# Altium schematic sheet Amplifier.SchDoc
size D; SheetNumber: 1; SheetTotal: 1
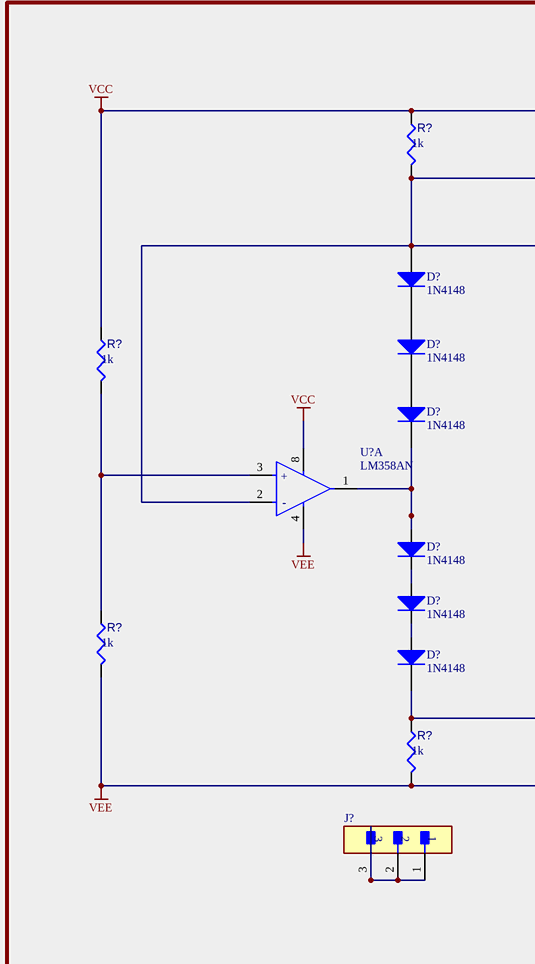
[diagram p0: Amplifier.SchDoc, top left]
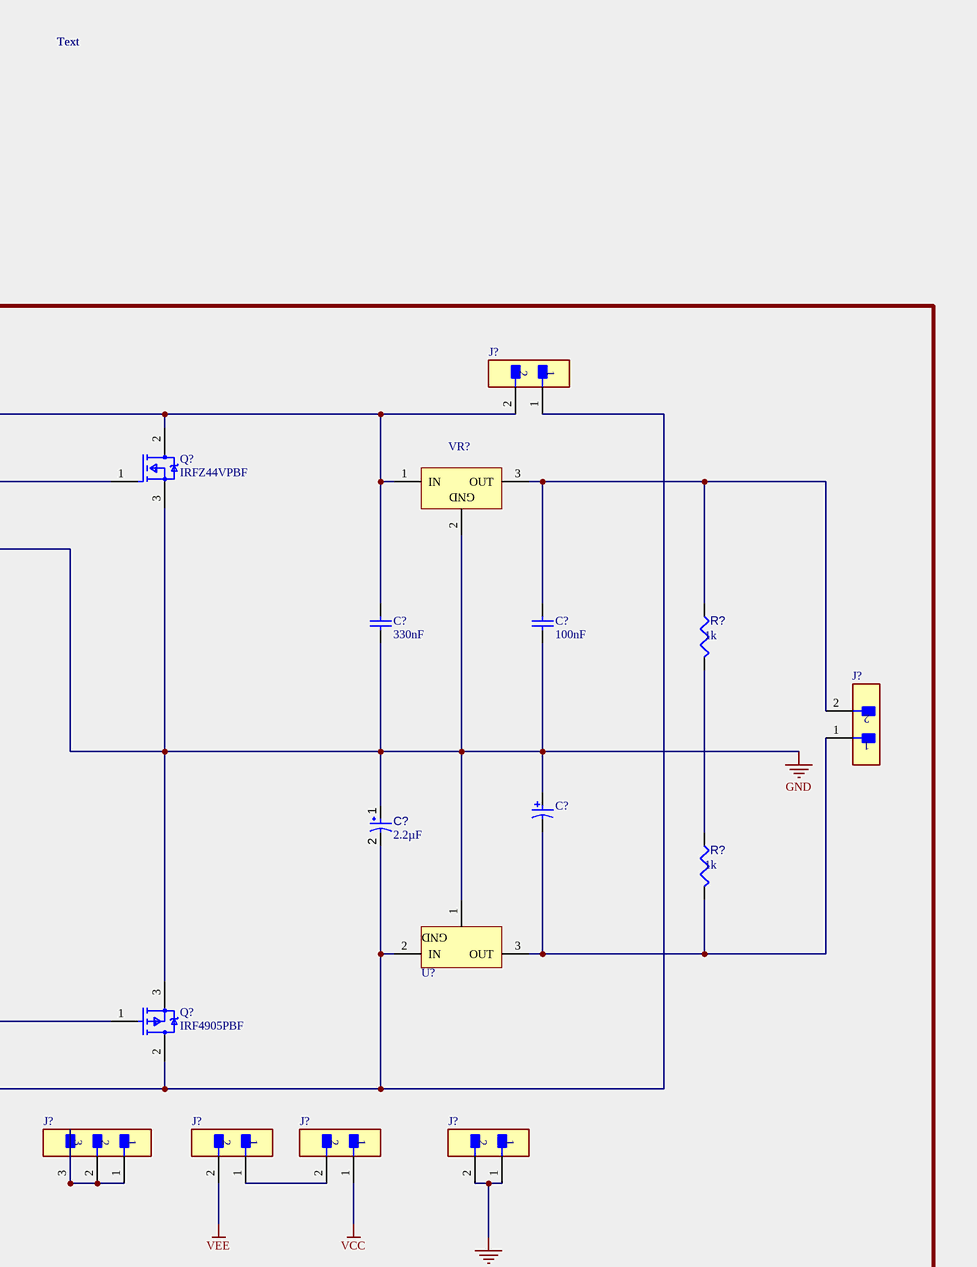
[diagram p1: Amplifier.SchDoc, top middle]
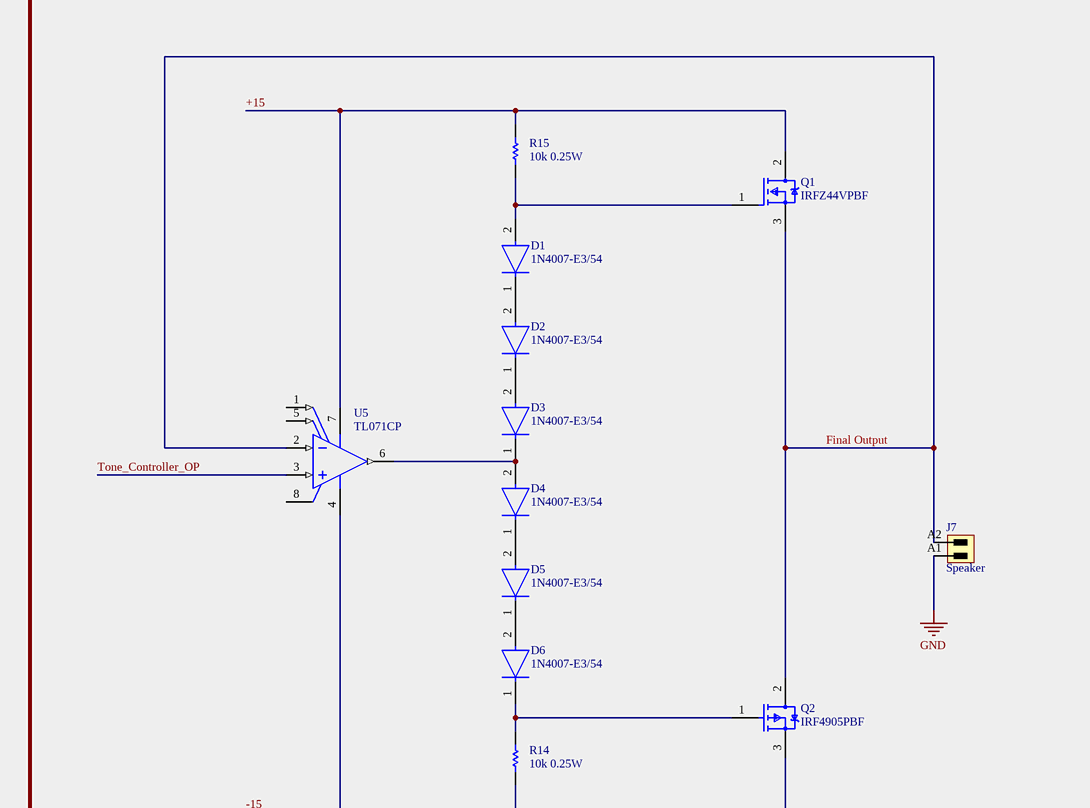
[diagram p2: Amplifier.SchDoc, top right]
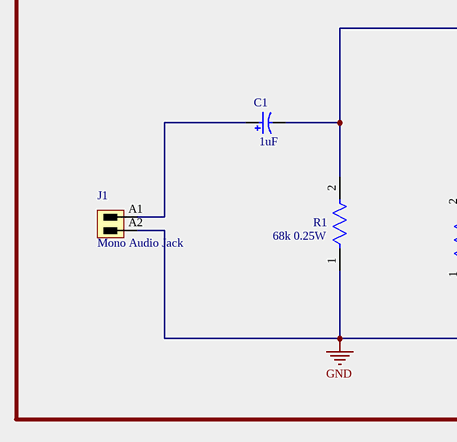
[diagram p3: Amplifier.SchDoc, bottom left]
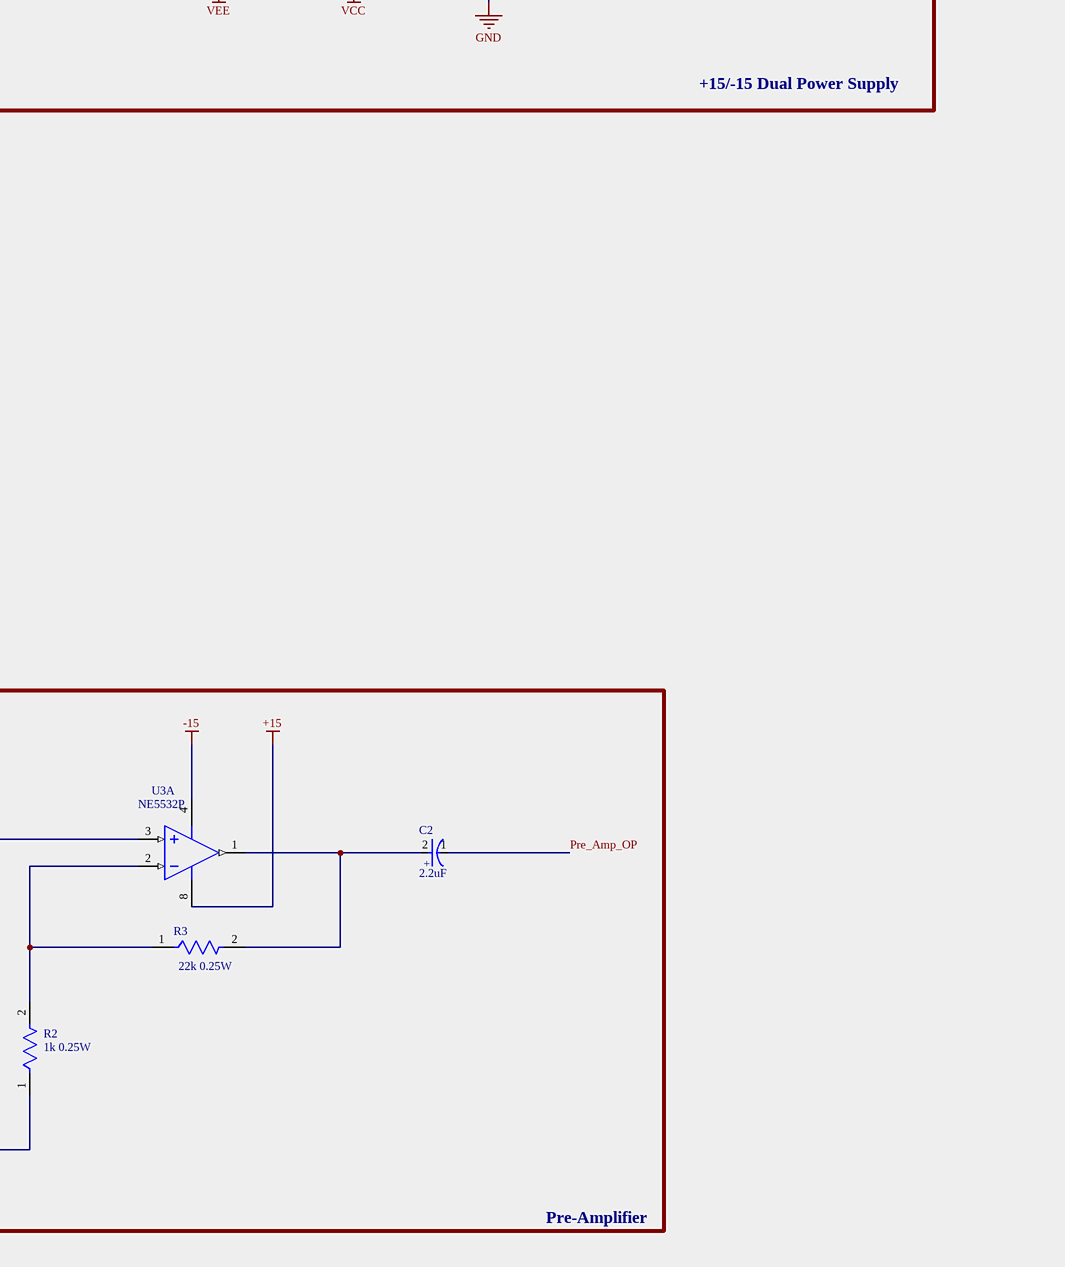
[diagram p4: Amplifier.SchDoc, bottom middle]
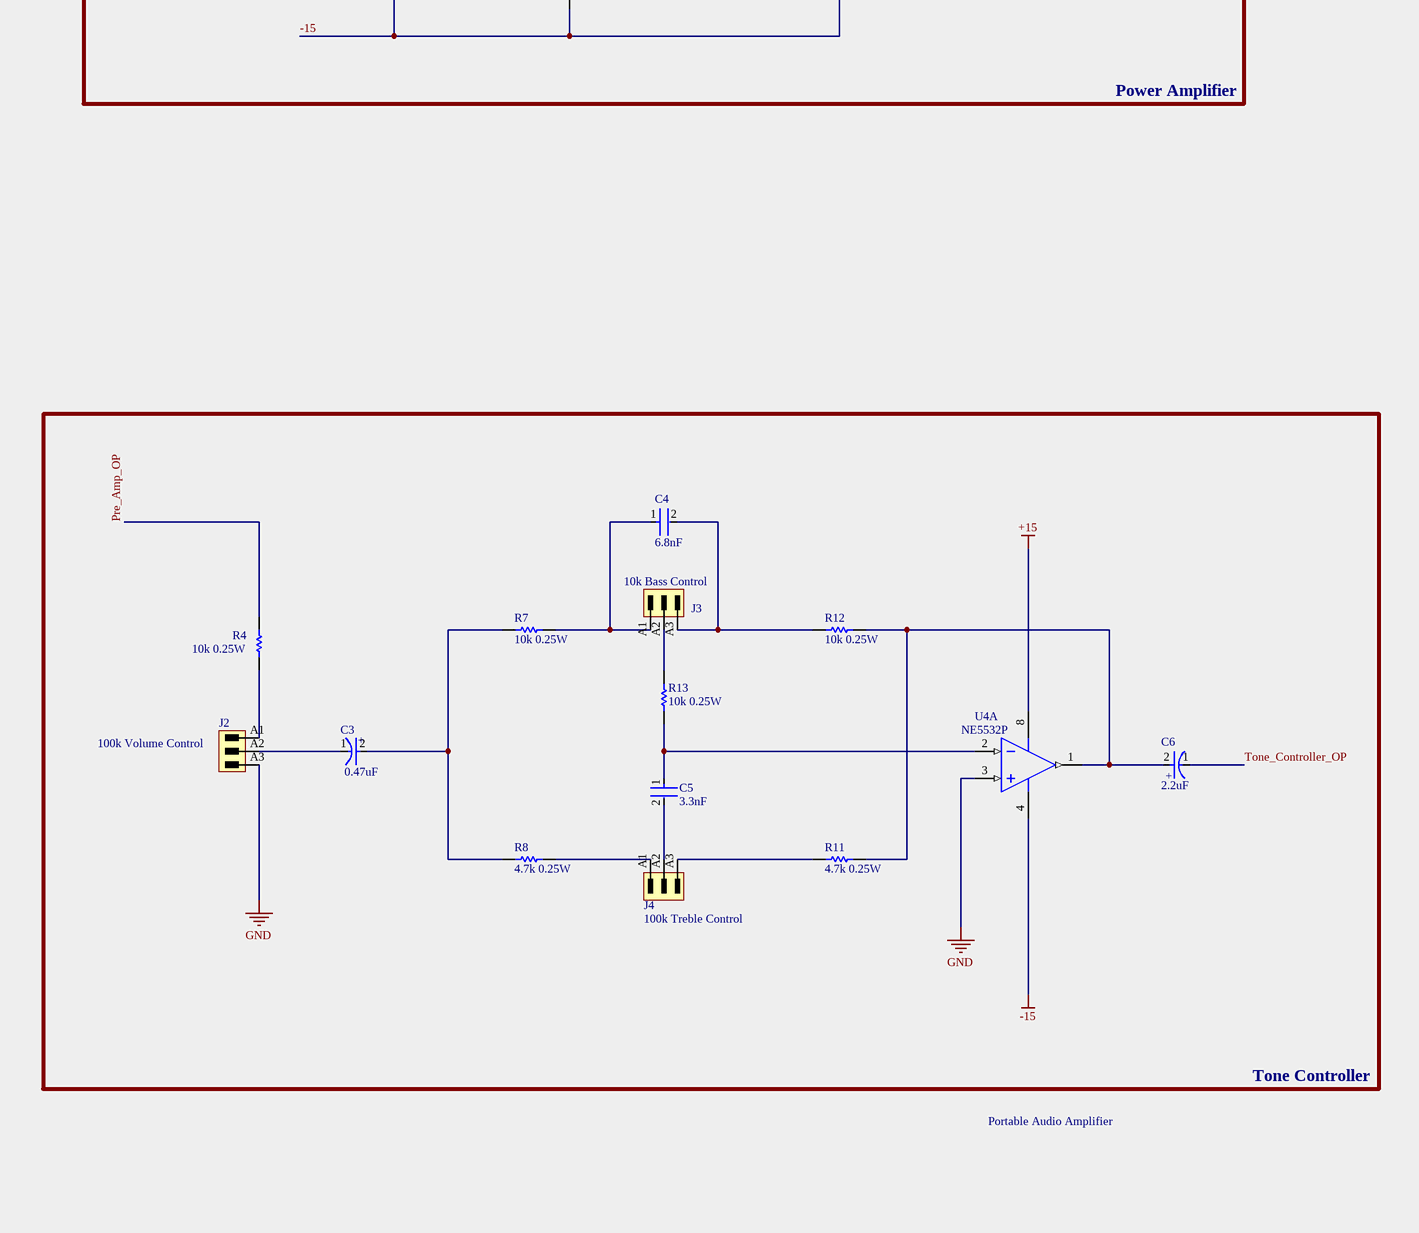
[diagram p5: Amplifier.SchDoc, bottom right]

## Parts
(Parts that share a designator on the sheet are numbered #1, #2 ... from top to bottom, then left to right.)
C1  1uF  [CAPPR55-200-1100X500X1200]
C2  2.2uF  [FP-RAD-TH-D_6_3_0_5-L_11-MFG]
C3  0.47uF  [FP-RAD-TH-D_5_0_5-L_11_1-MFG]
C4  6.8nF  [FP-RDE0M1-MFG]
C5  3.3nF  [FP-DE6_D10_T7_F7_5_d0_6-0-MFG]
C6  2.2uF  [FP-RAD-TH-D_6_3_0_5-L_11-MFG]
C?#1  330nF  [KEMT-C315-THT-2]
C?#2  100nF  [KEMT-C315-THT-2]
C?#3  ECA-1HHG010  [CAPPR55-200-1100X500X1200]  (value not drawn)
C?#4  value 2.2µF  [CAPPR55-200-1100X500X1200]  (hidden comment: ECA1HM2R2)
D1  1N4007-E3/54  [FP-1N4007-MFG]
D2  1N4007-E3/54  [FP-1N4007-MFG]
D3  1N4007-E3/54  [FP-1N4007-MFG]
D4  1N4007-E3/54  [FP-1N4007-MFG]
D5  1N4007-E3/54  [FP-1N4007-MFG]
D6  1N4007-E3/54  [FP-1N4007-MFG]
D?#1  1N4148  [NXP-SOD27-2_V]
D?#2  1N4148  [NXP-SOD27-2_V]
D?#3  1N4148  [NXP-SOD27-2_V]
D?#4  1N4148  [NXP-SOD27-2_V]
D?#5  1N4148  [NXP-SOD27-2_V]
D?#6  1N4148  [NXP-SOD27-2_V]
J1  Mono Audio Jack  [SC_SMT_3_81_180G_02]
J2  100k Volume Control  [SC_SMT_3_81_180G_03]
J3  10k Bass Control  [SC_SMT_3_81_180G_03]
J4  100k Treble Control  [SC_SMT_3_81_180G_03]
J7  Speaker  [SC_SMT_3_81_180G_02]
J?#1  B2B-XH-A(LF)(SN)  [FP-B2B-XH-A_LF_SN-MFG]  (value not drawn)
J?#2  B2B-XH-A(LF)(SN)  [FP-B2B-XH-A_LF_SN-MFG]  (value not drawn)
J?#3  B3B-XH-A(LF)(SN)  [FP-B3B-XH-A_LF_SN-MFG]  (value not drawn)
J?#4  B3B-XH-A(LF)(SN)  [FP-B3B-XH-A_LF_SN-MFG]  (value not drawn)
J?#5  B2B-XH-A(LF)(SN)  [FP-B2B-XH-A_LF_SN-MFG]  (value not drawn)
J?#6  B2B-XH-A(LF)(SN)  [FP-B2B-XH-A_LF_SN-MFG]  (value not drawn)
J?#7  B2B-XH-A(LF)(SN)  [FP-B2B-XH-A_LF_SN-MFG]  (value not drawn)
Q1  IRFZ44VPBF  [FP-PG-TO220-3-MFG]
Q2  IRF4905PBF  [FP-PG-TO220-3-MFG]
Q?#1  IRFZ44VPBF  [FP-PG-TO220-3-MFG]
Q?#2  IRF4905PBF  [FP-PG-TO220-3-MFG]
R1  68k 0.25W  [FP-RLR07-MFG]
R2  1k 0.25W  [FP-RLR07-MFG]
R3  22k 0.25W  [FP-RLR07-MFG]
R4  10k 0.25W  [OMTE-RES7X2.5-2]
R7  10k 0.25W  [OMTE-RES7X2.5-2]
R8  4.7k 0.25W  [OMTE-RES7X2.5-2]
R11  4.7k 0.25W  [OMTE-RES7X2.5-2]
R12  10k 0.25W  [OMTE-RES7X2.5-2]
R13  10k 0.25W  [OMTE-RES7X2.5-2]
R14  10k 0.25W  [OMTE-RES7X2.5-2]
R15  10k 0.25W  [OMTE-RES7X2.5-2]
R?#1  value 1k  [RESA60-630X240]  (hidden comment: CFR-25JB-52-470K)
R?#2  value 1k  [RESA60-630X240]  (hidden comment: CFR-25JB-52-470K)
R?#3  value 1k  [RESA60-630X240]  (hidden comment: CFR-25JB-52-470K)
R?#4  value 1k  [RESA60-630X240]  (hidden comment: CFR-25JB-52-470K)
R?#5  value 1k  [RESA60-630X240]  (hidden comment: CFR-25JB-52-470K)
R?#6  value 1k  [RESA60-630X240]  (hidden comment: CFR-25JB-52-470K)
U3  NE5532P  [P0008A]  (part A of 2)
U4  NE5532P  [P0008A]  (part A of 2)
U5  TL071CP  [P0008A]
U?#1  LM358AN  [FP-626-05-MFG]  (part A of 2)
U?#2  LM7912CT/NOPB  [NDE0003A]  (value not drawn)
VR?  L7805CV  [TO220]  (value not drawn)

## Blocks framed on the sheet
+15/-15 Dual Power Supply: C?#1-C?#4 D?#1-D?#6 J?#1-J?#7 Q?#1 Q?#2 R?#1-R?#6 U?#1 U?#2 VR?
Power Amplifier: D1-D6 J7 Q1 Q2 R14 R15 U5
Tone Controller: C3-C6 J2-J4 R4 R7 R8 R11-R13 U4
Pre-Amplifier: C1 C2 J1 R1-R3 U3

## Nets
+15: Q1.2(DRAIN) R15.1 U3.8(VCC+) U4.8(VCC+) U5.7(VCC+)
-15: Q2.3(SOURCE) R14.2 U3.4(VCC-) U4.4(VCC-) U5.4(VCC-)
GND: C?#1.1 C?#2.1 C?#3.1 C?#4.1 D?#1.1(A) J1.A2 J2.A3 J7.A1 J?#7.1 J?#7.2 Q?#1.1(GATE) Q?#1.3(SOURCE) Q?#2.3(SOURCE) R1.1 R2.1 R?#1.2 U4.3(IN1+) U?#1.2(IN1(-)) U?#2.1(GND) VR?.2(GND)
VCC: C?#1.2 J?#1.2 J?#6.1 Q?#1.2(DRAIN) R?#1.1 R?#3.1 U?#1.8(VCC) VR?.1(IN)
VEE: C?#4.2 J?#1.1 J?#5.2 Q?#2.2(DRAIN) R?#5.2 R?#6.2 U?#1.4(GND) U?#2.2(IN)
Pre_Amp_OP: C2.1(C) R4.2
Tone_Controller_OP: C6.1(C) U5.3(IN+)
NetC1_1: C1.1 J1.A1
NetC1_2: C1.2 R1.2 U3.3(IN1+)
NetC2_2: C2.2(A) R3.2 U3.1(OUT1)
NetC3_1: C3.1(C) J2.A2
NetC3_2: C3.2(A) R7.2 R8.2
NetC4_1: C4.1 J3.A1 R7.1
NetC4_2: C4.2 J3.A3 R12.2
NetC5_1: C5.1 R13.2 U4.2(IN1-)
NetC5_2: C5.2 J4.A2
NetC6_2: C6.2(A) R11.1 R12.1 U4.1(OUT1)
NetC?#2_2: C?#2.2 J?#2.2 R?#2.1 VR?.3(OUT)
NetC?#3_2: C?#3.2 J?#2.1 R?#4.2 U?#2.3(OUT)
NetD1_1: D1.1(C) D2.2(A)
NetD1_2: D1.2(A) Q1.1(GATE) R15.2
NetD2_1: D2.1(C) D3.2(A)
NetD3_1: D3.1(C) D4.2(A) U5.6(OUT)
NetD4_1: D4.1(C) D5.2(A)
NetD5_1: D5.1(C) D6.2(A)
NetD6_1: D6.1(C) Q2.1(GATE) R14.1
NetD?#1_2: D?#1.2(K) D?#2.1(A)
NetD?#2_2: D?#2.2(K) D?#3.1(A)
NetD?#3_2: D?#3.2(K) D?#4.1(A) U?#1.1(OUT1)
NetD?#4_2: D?#4.2(K) D?#5.1(A)
NetD?#5_2: D?#5.2(K) D?#6.1(A)
NetD?#6_2: D?#6.2(K) Q?#2.1(GATE) R?#6.1
NetJ2_A1: J2.A1 R4.1
NetJ3_A2: J3.A2 R13.1
NetJ4_A1: J4.A1 R8.1
NetJ4_A3: J4.A3 R11.2
NetJ7_A2: J7.A2 Q1.3(SOURCE) Q2.2(DRAIN) U5.2(IN-)
NetJ?#3_1: J?#3.1 J?#3.2 J?#3.3
NetJ?#4_1: J?#4.1 J?#4.2 J?#4.3
NetJ?#5_1: J?#5.1 J?#6.2
NetR2_2: R2.2 R3.1 U3.2(IN1-)
NetR?#2_2: R?#2.2 R?#4.1
NetR?#3_2: R?#3.2 R?#5.1 U?#1.3(IN1(+))

Not connected (* = marked no-connect by the designer): U5 1(OFFSET_N1) 5(OFFSET_N2) 8(NC)

## Notes on the sheet
- Text
- Final Output
- Portable Audio Amplifier
- (in symbol CMP-05427-001047-1) +
- (in symbol CMP-05427-001349-1) +
- (in symbol CMP-07106-000007-1, part A) +; -

## Library data of the parts
C1 C?#3 = CMP-1665-00039-1: Aluminum Electrolytic Capacitor, 1 uF, +/- 20%, 50 V, -55 to 105 degC, 2-Pin THD, RoHS, Bulk; Channels: 2; ComponentLink1Description: Manufacturer URL; ComponentLink2Description: Datasheet; ComponentLink2URL: https://datasheet.ciiva.com/7275/94060-7275472.pdf; PackageDescription: 2-Pin Radial Lead, Dia 5 mm, Body Length 11 mm; PackageReference: CAPPR55-200-1100X500X1200; Mount: Through Hole; Radiation Hardening: No; ComponentLink1URL: http://www.panasonic.com/; Min Operating Temperature: -30 degC; Package Quantity: 150; Max Operating Temperature: 70 degC; DatasheetVersion: Mar-05; RoHSCompliant: true; Packaging: Bulk
C2 C6 = CMP-05427-001349-1: Aluminum Electrolytic Capacitors (Radial Lead Type) 2.2uF ±20% 160V; Dielectric Material: Aluminium; Lead/Base Style: Straight; Lead Diameter: 0.5mm; Dissipation Factor: 0.15%; Ripple Current (AC): 25mA; Life (Hours): 2000Hour; Voltage Rating (DC): 160V; Lead Pitch: 2.5mm; Voltage Rating: 160V; Height - Seated (Max): 0.48inch; Number of Pins: 2; Case/Package: Radial; Termination: Radial; Mount: Through Hole; Series: NHG; Construction: RADIAL; REACH SVHC: No SVHC; Height: 11.2mm; Voltage: 160V; Length: 11.2mm; Lead Free: Lead Free; Diameter: 6.3mm; Radiation Hardening: No; Ripple Current: 25mA; Max Operating Temperature: 105°C; Tolerance: 20%; RoHS Compliant: Yes; Capacitance: 2.2uF; Min Operating Temperature: -25°C; Packaging: Bulk; Package Quantity: 200; Contact Plating: Tin
C3 = CMP-05427-001047-1: Aluminum Electrolytic Capacitors (Radial Lead Type) 0.47uF ±20% 63V; Life (Hours): 5000Hour; Ripple Current: 4.5mA; Lead Diameter: 0.5mm; Leakage Current: 3uA; Capacitance: 470nF; Polarity: Polar; Construction: RADIAL; Number of Pins: 2; Tolerance: 20%; Series: EB; Voltage Rating: 63V; Min Operating Temperature: -40°C; Lead Pitch: 2mm; Termination: Radial; Voltage Rating (DC): 63V; Package Quantity: 200; REACH SVHC: No SVHC; Length: 11mm; Ripple Current (AC): 4.5mA; Height - Seated (Max): 0.433inch; Diameter: 5mm; Height: 11mm; Lead Free: Lead Free; RoHS Compliant: Yes; Mount: Through Hole; Voltage: 63V; Radiation Hardening: No; Packaging: Bulk; Max Operating Temperature: 105°C; Case/Package: Radial
C4 = CMP-06035-012055-1: Ceramic Capacitor 6.8nF ±10% 100V X7R Radial; Lead/Base Style: Kinked; Lead Diameter: 0.5mm; Lead Pitch: 0.197inch; Lead Free: Lead Free; Length: 0.157inch; Tolerance: 10%; Resistor Type: Ceramic; Voltage Rating: 100V; Capacitance: 6.8nF; Case/Package: Radial; Max Operating Temperature: 125°C; Width: 0.098inch; Dielectric: X7R; Min Operating Temperature: -55°C; Termination: Radial; Package Quantity: 2000; Voltage Rating (DC): 100V; Packaging: Tape and Reel; Height: 3.5mm; Height - Seated (Max): 0.236inch; Mount: Through Hole
C5 = CMP-06035-062531-1: CAP CER 3300PF 300VAC RADIAL; Tolerance: 20%; Lead/Base Style: Formed Leads; Voltage Rating (AC): 300V; Lead Diameter: 0.6mm; Package Quantity: 700; Depth: 7mm; Series: KJ; Mount: Through Hole; REACH SVHC: No SVHC; Capacitance: 3.3nF; Termination: Radial; Resistor Type: Ceramic; Ratings: AEC-Q200; Width: 7mm; Max Operating Temperature: 125°C; Packaging: Cut Tape; Height - Seated (Max): 0.512inch; Lead Pitch: 7.5mm; Case/Package: Radial; Min Operating Temperature: -25°C
C?#1 C?#2 = CMP-1664-00008-1: Capacitor, Ceramic, 22 pF, +/-10 %, 100 V, -55 to 125 degC, 2-Pin THD, RoHS, Bulk; Max Input Voltage: 40 V; Min Input Voltage: 4.2 V; Output Current: 1.5 A; Output Voltage: 1.2 V; Outputs: 1; Case\Package: TO-220; RoHSCompliant: true; Min Operating Temperature: 0 degC; Max Operating Temperature: 125 degC; Package Quantity: 50; ComponentLink2URL: http://capacitoredge.kemet.com/capedge2/DataSheet/Datasheet-C315C220K1G5TA.pdf?pn=C315C220K1G5TA{BULK}; Radiation Hardening: No; Pins: 3; Length: 10.28 mm; ComponentLink1URL: http://www.kemet.com/; ComponentLink2Description: Datasheet; Height: 9.28 mm; REACH SVHC: No SVHC; ComponentLink1Description: Manufacturer URL; Max Ouput Current: 1.5 A; Weight: 0.08113 oz; Packaging: Rail/Tube; DatasheetVersion: Aug-16; Mount: Through Hole; PackageReference: C315-THT-2; Width: 4.82 mm; PackageDescription: 2-Pin Through Hole Device, Body 3.81 x 2.54 mm
C?#4 = CMP-001-00029-7: Aluminum Electrolytic Capacitor, 2.2 uF, +/- 20%, 50 V, -40 to 85 degC, 2-Pin THD, RoHS, Bulk; Manufacturer: Panasonic; Voltage Rating: 50V; Ripple Current: 20mA; Package Description: 2-Pin Radial Lead, Dia 5 mm, Height 12 mm; Manufacturer URL: http://www.panasonic.com/; Tolerance: 20%; Diameter: 5mm; Pins: 2; Mounting Technology: TH; Capacitor Type: Electrolytic; RoHS Compliant: True; Min Operating Temperature: -40°C; Case/Package: Radial; Datasheet URL: https://industrial.panasonic.com/cdbs/www-data/pdf/RDF0000/ABA0000C1218.pdf; Lead Pitch: 2mm; Max Operating Temperature: 85°C; Packaging: Bulk; Package Reference: CAPPR55-200-1100X500X1200; Datasheet Version: Rev. 05, 10/2016; Ripple Current (AC): 20mA; Package Quantity: 200
D1-D6 = CMP-02540-000046-1: DIODE GEN PURP 1KV 1A DO204AL; Manufacturer: Vishay; Value: 15pF; Max Junction Temp: +150°C; Max Surge Forward Current: 30A; Max Repetitive Reverse Voltage: 1000V; Peak Reverse Current: 30uA; Octopart: https://octopart.com/1n4007-e3%2F54-vishay-39548207; Digikey Description: DIODE GEN PURP 1KV 1A DO204AL; Category: Diode; Mouser Description: Rectifiers Vr/1000V Io/1A; Automotive: No; Package: 1N4007; Device Class L3: Rectifier Diodes; Temperature Range High: +150°C; Capacitance: 15pF; Ipc Land Pattern Name: DIOPA1088W105L520D270; Lead Free: Yes; ComponentLink2Description: Datasheet; Forward Current: 1A; Device Class L1: Discrete Semiconductors; ComponentLink2URL: http://www.vishay.com/docs/88503/1n4001.pdf; Temperature Range Low: -50°C; Height: 2.7mm; RoHS: TRUE; Temperature: -50°C to +150°C; Device Class L2: Diodes; Manufacturer Part Number: 1N4007-E3/54
D?#1-D?#6 = CMP-004-00000-2: High Speed Diode, 100 V, 0.45 A, -65 to 175 degC, 2-Pin SOD27, RoHS, Bulk; Manufacturer: Fairchild; Elements: 1; Recovery Time: 4ns; Forward Current: 300mA; Power: 500mW; Forward Voltage: 1V; Max Surge Current: 4A; Peak Reverse Current: 5uA; Datasheet URL: http://www.nxp.com/documents/data_sheet/1N4148_1N4448.pdf; Min Operating Temperature: -65°C; Manufacturer URL: https://www.fairchildsemi.com/; Packaging: Bulk; Diameter: 1.91mm; Pins: 2; Package URL: http://www.nxp.com/documents/data_sheet/1N4148_1N4448.pdf; Package Reference: SOD27; Max Operating Temperature: 175°C; Package Quantity: 2000; Case/Package: DO; Datasheet Version: Aug-04; RoHS Compliant: True
J1 J7 = CMP-1559-00412-1: OMNIMATE Signal - series BC/SC 3.81; PartNumber: 1863720000; Manufacturer: Weidmueller; UL_94_flammability_rating: V-0; Rated_voltage_use_group_B_UL_1059: 300 V; Pitch_mm: 3.81 mm; Mounting_onto_the_PCB: Reflow solder connection; Insulating_material: LCP GF; Rated_voltage_for_surge_voltage_class_pollution_degree_II_2: 320 V; No_of_poles: 2; Outgoing_elbow: 180°; Rated_current_use_group_B_UL_1059: 10 A; Side_termination_characteristic: closed side; Pitch_inch: 0.15 inch; Solder_pin_length_mm: 1.5 mm; Short_text_for_material: SC-SMT 3.81/02/180G 1.5SN BK BX; Contact_surface: tinned; Rated_current_min_no_of_poles_TU_20_deg_C: 17.5 A; PackageReference: SC_SMT_3_81_180G_02; Revision: V1; ComponentLink2Description: URL Link1; Colour: Black; ComponentLink1Description: Manufacturer URL; Packaging: Box; Qty: 50 PCS; ComponentLink1URL: http://www.weidmueller.com/; ComponentLink2URL: http://catalog.weidmueller.com/catalog/Start.do?localeId=en&ObjectID=1863720000
J2-J4 = CMP-1559-00420-1: OMNIMATE Signal - series BC/SC 3.81; PartNumber: 1862940000; Manufacturer: Weidmueller; No_of_poles: 3; Rated_voltage_use_group_B_UL_1059: 300 V; Contact_material: Cu-Leg; Rated_current_use_group_B_UL_1059: 10 A; Pitch_inch: 0.15 inch; Rated_current_min_no_of_poles_TU_20_deg_C: 19 A; Pitch_mm: 3.81 mm; Insulating_material: LCP GF; Solder_pin_length_mm: 3.2 mm; Side_termination_characteristic: closed side; Contact_surface: tinned; Outgoing_elbow: 180°; Mounting_onto_the_PCB: Reflow solder connection; UL_94_flammability_rating: V-0; Rated_voltage_for_surge_voltage_class_pollution_degree_II_2: 320 V; Short_text_for_material: SC-SMT 3.81/03/180G 3.2SN BK BX; ComponentLink2Description: URL Link1; ComponentLink1URL: http://www.weidmueller.com/; ComponentLink1Description: Manufacturer URL; PackageReference: SC_SMT_3_81_180G_03; Revision: V1; ComponentLink2URL: http://catalog.weidmueller.com/catalog/Start.do?localeId=en&ObjectID=1862940000; Qty: 50 PCS; Colour: Black; Packaging: Box
J?#1 J?#2 J?#5-J?#7 = CMP-2000-05888-3: CONN HEADER VERT 2POS 2.5MM; Current Rating: 3A; Voltage Rating: 250V; Number of Contacts: 2; Contact Resistance: 20mR; Wire/Cable Gauge: 22AWG; Insulation Resistance: 1GR; Connector Type: Male Pin; Packaging: Bulk; Contact Material: Brass; Lead Free: Lead Free; Orientation: Straight; Contact Plating: Tin; Max Current Rating: 3A; Termination: Solder; Fastening Type: Detent; Depth: 5.75mm; Housing Material: Polyamide; REACH SVHC: No SVHC; Series: XH; Voltage Rating (AC): 250V; Number of Positions: 2; Color: Natural; Contact Type: Male Pin; Max Voltage Rating (DC): 250V; Pitch: 2.5mm; Lead Pitch: 2.5mm; Mount: Through Hole; Max Operating Temperature: 85°C; Length: 7.4mm; Max Voltage Rating (AC): 250V; Min Operating Temperature: -25°C; Number of Rows: 1; Housing Color: White
J?#3 J?#4 = CMP-17439-000014-3: CONN HEADER VERT 3POS 2.5MM; Max Voltage Rating (DC): 250V; Number of Positions: 3; Current Rating: 3A; Gender: Male; Wire/Cable Gauge: 22AWG; Contact Resistance: 20mR; Insulation Resistance: 1GR; Insulation Material: Nylon; Contact Plating: Tin; Depth: 5.75mm; Contact Type: Male Pin; Max Operating Temperature: 85°C; Insulation Color: Natural; Voltage Rating (AC): 250V; Color: Natural; Connector Type: Header; Orientation: Straight; Fastening Type: Detent; Housing Color: White; Min Operating Temperature: -25°C; Termination: Solder; Voltage Rating: 250V; Series: XH; Pitch: 2.5mm; Contact Shape: Square; Number of Rows: 1; Lead Free: Lead Free; Packaging: Bulk; Mount: Through Hole; Flammability Rating: UL94 V-0; Max Voltage Rating (AC): 250V; REACH SVHC: No SVHC; Housing Material: Polyamide; Contact Material: Brass; Lead Pitch: 2.5mm; Contact Finish - Mating: TIN; Length: 9.9mm; Max Current Rating: 3A; Number of Contacts: 3
Q1 Q?#1 = CMP-32901-001154-1: MOSFET N-CH 60V 55A TO220AB; Polarization: N; Power Dissipation: 115W; Rds On Max: 16.5mR; Gate to Source Voltage (Vgs): 20V; Threshold Voltage: 4V; Turn-On Delay Time: 13ns; Element Configuration: Single; Input Capacitance: 1.812nF; Turn-Off Delay Time: 40ns; Mount: Through Hole; Drain to Source Voltage (Vdss): 60V; Max Dual Supply Voltage: 60V; Length: 0.42inch; Height: 0.65inch; Width: 0.19inch; Packaging: Rail/Tube; Halogen Free: Halogen Free; Number of Pins: 3; Continuous Drain Current (ID): 55A; Drain to Source Resistance: 16.5mR; Series: HEXFET®; RoHS Compliant: Yes; Reach SVHC Compliant: Yes; Drain to Source Breakdown Voltage: 60V; Max Operating Temperature: 175°C; Case/Package: TO-220; Max Power Dissipation: 115W; Lead Free: Lead Free; Min Operating Temperature: -55°C
Q2 Q?#2 = CMP-32901-000200-1: MOSFET P-CH 55V 74A TO-220AB; Drain to Source Resistance: 20mR; Input Capacitance: 3.4nF; Max Dual Supply Voltage: -55V; Power Dissipation: 200W; Turn-On Delay Time: 18ns; Element Configuration: Single; Threshold Voltage: -4V; Gate to Source Voltage (Vgs): 20V; Turn-Off Delay Time: 61ns; Number of Pins: 3; Packaging: Rail/Tube; RoHS Compliant: Yes; REACH SVHC: No SVHC; Halogen Free: Halogen Free; Max Power Dissipation: 200W; Drain to Source Breakdown Voltage: -55V; Length: 0.414inch; Drain to Source Voltage (Vdss): -55V; Height: 0.6inch; Case/Package: TO-220; Width: 0.185inch; Continuous Drain Current (ID): 74A; Mount: Through Hole; Min Operating Temperature: -55°C; Lead Free: Lead Free; Max Operating Temperature: 175°C; Rds On Max: 20mR
R1-R3 = CMP-00030-42769933-1: RLR07C15R0FSB14 Res Metal Film 15 Ohm 1% 1/4W ±100ppm/°C 0.001% Conformal AXL Thru-Hole Bulk; Power Rating: 250mW; Resistance: 15Ω; Failure Rate: 0.001%; Contact Plating: Lead, Tin; Case/Package: Conformal; Width: 2.29mm; Min Operating Temperature: -65°C; Number of Terminations: 2; Features: Military, Moisture Resistant, Weldable; Military Standard: MIL-PRF-39017; Length: 7.62mm; NexarPartId: 42769933; Temperature Coefficient: 100ppm/°C; Mount: Through Hole; Tolerance: 1%; Diameter: 2.29mm; Max Operating Temperature: 150°C; Packaging: Bulk; Schedule B: 8533210090; Max Power Dissipation: 250mW; Lead Free: Contains Lead; Termination: Axial; RoHS: Compliant; Composition: Metal Film
R4 R7 R12-R15 = CMP-2000-06865-1: Little Demon(R) Carbon Composition Molded OD Series, 250 V, 10 KOhm, +/-5%, -70 to 130 degC, 2-Pin THD, RoHS, Bulk; PartNumber: OD103JE; Manufacturer: Ohmite; Power (Watts): 0.25W,1/4W; Tolerance: ±5%; Online Catalog: OD,OF,OASeries,LittleDemon®; Catalog Drawings: OD,OF,OASeries; EDA / CAD Models: DownloadfromAcceleratedDesigns; Mounting Technology: ThroughHole; Datasheet Version: 06/2016; RoHS Information: LittleDemon"E"SeriesMaterialDeclaration; Number of Terminations: 2; Temperature Coefficient: -; Height: -; Resistance (Ohms): 10k; Composition: CarbonComposition; Power Rating: 0.25W; Package Description: 2-Pin THD Resistor, Body 7 x 2.5 mm, Lead Dia. 0.6 mm; Size / Dimension: 0.098"Diax0.276"L(2.50mmx7.00mm); Category: Resistors; Manufacturer URL: http://www.ohmite.com/; Features: PulseWithstanding; Family: ThroughHoleResistors; Supplier Device Package: Axial; Package / Case: Axial; Standard Package: 100; Package Reference: RES7X2.5; Operating Temperature: -; Series: LittleDemon®OD; Datasheet URL: http://www.ohmite.com/cat/res_od_of_oa.pdf; Packaging: Bulk
R8 R11 = CMP-2000-06865-1: Little Demon(R) Carbon Composition Molded OD Series, 250 V, 10 KOhm, +/-5%, -70 to 130 degC, 2-Pin THD, RoHS, Bulk; PartNumber: OD103JE; Manufacturer: Ohmite; Resistance (Ohms): 10k; Power (Watts): 0.25W,1/4W; Tolerance: ±5%; Online Catalog: OD,OF,OASeries,LittleDemon®; Catalog Drawings: OD,OF,OASeries; EDA / CAD Models: DownloadfromAcceleratedDesigns; Mounting Technology: ThroughHole; Datasheet Version: 06/2016; RoHS Information: LittleDemon"E"SeriesMaterialDeclaration; Number of Terminations: 2; Temperature Coefficient: -; Height: -; Composition: CarbonComposition; Power Rating: 0.25W; Package Description: 2-Pin THD Resistor, Body 7 x 2.5 mm, Lead Dia. 0.6 mm; Size / Dimension: 0.098"Diax0.276"L(2.50mmx7.00mm); Category: Resistors; Manufacturer URL: http://www.ohmite.com/; Features: PulseWithstanding; Family: ThroughHoleResistors; Supplier Device Package: Axial; Package / Case: Axial; Standard Package: 100; Package Reference: RES7X2.5; Operating Temperature: -; Series: LittleDemon®OD; Datasheet URL: http://www.ohmite.com/cat/res_od_of_oa.pdf; Packaging: Bulk
R?#1-R?#6 = CMP-009-00055-4: RES 470K OHM 5% 1/4W AXIAL; Manufacturer: Yageo; Power: 250mW; Voltage Rating: 250V; Tolerance: 1%; Case/Package: Axial; Mounting Technology: TH; RoHS Compliant: True; Package Description: 2-Pin Axial Lead, Dia 2.4 mm, Body Length 6.3 mm; Min Operating Temperature: -55°C; Datasheet URL: http://www.yageo.com/documents/recent/Yageo%20LR_MFR_2013.pdf; Manufacturer URL: http://www.yageo.com/; Package Quantity: 200; Package Reference: MFR-25; Max Operating Temperature: 155°C; Datasheet Version: Apr-13; Packaging: Bulk
U3 U4 = CMP-0017-00910-2: Dual Low-Noise High-Speed Audio Operational Amplifier, 10 to 30 V, 0 to 70 degC, 8-pin DIP (P8), Pb-Free (RoHS); Manufacturer: Texas Instruments; Iq per channel(Max)(mA): 4; Slew Rate(Typ)(V/us): 9; Vn at 1kHz(Typ)(nV/rtHz): 5; IIB(Max)(pA): 800000; Total Supply Voltage(Max)(+5V is 5, +/-5V is 10): 30; GBW(Typ)(MHz): 10; CMRR(Min)(dB): 70; Number of Channels: 2; Sub Family: General Purpose Amplifier, High Supply Voltage Amplifier (>=30V), Low Noise Amp (<=10nV/rtHz); ComponentLink2URL: http://www.ti.com/lit/ds/symlink/ne5532.pdf; PackageReference: P0008A; PackageDescription: 8-Pin Plastic In-Line, Body 9.59 x 6.35 mm, Pitch 2.54 mm; ComponentLink1Description: Manufacturer URL; Eco-Plan: Pb-Free (RoHS); Mounting Technology: Through Hole; Code_JEDEC: MS-001; PackageVersion: 4040082/E, 04/2010; DatasheetVersion: SLOS075I; ComponentLink3URL: http://www.ti.com/litv/pdf/mpdi001b; ComponentLink2Description: Datasheet; Vio (25C)(Max)(mV): 4; PartNumber: NE5532P; ComponentLink3Description: Package Specification; Total Supply Voltage(Min)(+5V is 5, +/-5V is 10): 10; ComponentLink1URL: http://www.ti.com/
U5 = CMP-0017-00972-2: Low-Noise JFET-Input General-Purpose Operational Amplifier, 7 to 36 V, 0 to 70 degC, 8-pin DIP (P8), Pb-Free (RoHS); Manufacturer: Texas Instruments; Total Supply Voltage(Min)(+5V is 5, +/-5V is 10): 7; Iq per channel(Max)(mA): 2.5; GBW(Typ)(MHz): 3; Vio (25C)(Max)(mV): 10; CMRR(Min)(dB): 70; Rating: Military; Vn at 1kHz(Typ)(nV/rtHz): 18; IIB(Max)(pA): 200; Number of Channels: 1; Sub Family: General Purpose Amplifier, High Supply Voltage Amplifier (>=30V); Total Supply Voltage(Max)(+5V is 5, +/-5V is 10): 36; Slew Rate(Typ)(V/us): 13; ComponentLink1Description: Manufacturer URL; PackageReference: P0008A; ComponentLink3Description: Package Specification; ComponentLink3URL: http://www.ti.com/litv/pdf/mpdi001b; Mounting Technology: Through Hole; ComponentLink2Description: Datasheet; ComponentLink2URL: http://www.ti.com/lit/ds/symlink/tl071.pdf; PartNumber: TL071CP; Eco-Plan: Pb-Free (RoHS); Offset Drift(Typ)(uV/C): 18; Code_JEDEC: MS-001; DatasheetVersion: SLOS080J; PackageVersion: 4040082/E, 04/2010; PackageDescription: 8-Pin Plastic In-Line, Body 9.59 x 6.35 mm, Pitch 2.54 mm; ComponentLink1URL: http://www.ti.com/
U?#1 = CMP-07106-000007-1: IC OPAMP GP 2 CIRCUIT 8DIP; Manufacturer: ON Semiconductor; Input Bias Current: 0.045uA; Max Junction Temp: +150°C; Nominal Supply Current: 0.5-0.8mA; Max Supply Voltage: 32V; Min Supply Voltage: 3V; Input Offset Voltage: 2mV; Voltage Gain: 100dB; Output Current Per Channel: 100-15000uA; Standoff Height: 0.38mm; Number Of Channels: 2; Min Dual Supply Voltage: 1.5V; Max Dual Supply Voltage: 16V; Ipc Land Pattern Name: DIP794W46P254L1016H533Q8; Lead Free: Yes; Manufacturer Part Number: LM358AN; Device Class L2: Linear ICs; ComponentLink2Description: Datasheet; Octopart: https://octopart.com/lm358an-on+semiconductor-84329698; Category: IC; ComponentLink2URL: https://www.onsemi.com/pub/Collateral/LM358A-D.pdf; Device Class L3: Amplifiers - Op Amps; Footprint Url: https://www.onsemi.com/pub/Collateral/626-05.PDF; Temperature: 0°C to +70°C; Mouser Description: Operational Amplifiers - Op Amps DIP-8 Dual Op Amp; Device Class L1: Integrated Circuits (ICs); Height: 5.33mm; RoHS: TRUE; Temperature Range Low: 0°C; Temperature Range High: +70°C; Automotive: No; Digikey Description: IC OPAMP GP 2 CIRCUIT 8DIP; Package: 626-05
U?#2 = CMP-0062-02473-3: 3-Terminal Negative Regulator, 3-pin TO-220, Pb-Free; Manufacturer: Texas Instruments; PackageTopMarking: NSUZXYTTE#*LM7912CT; CompType: LDO IC; PowerWise: N; RoHS: Y; PackageDescription: TO-220, Molded, 3 Lead, Straight; PackageReference: NDE0003A; PinCount: 3; ComponentLink1URL: http://www.ti.com/general/docs/lit/getliterature.tsp?genericPartNumber=LM7912&fileType=pdf; ComponentLink1Description: Datasheet URL
VR? = CMP-019-00018-3: Manufacturer: STMicroelectronics; Max Input Voltage: 35V; Min Supply Voltage: 8V; Nominal Output Voltage: 5V; Outputs: 1; Output Current: 1.5A; Dropout Voltage: 2V; Max Supply Voltage: 20V; Min Input Voltage: 7V; Datasheet Version: Rev 30, 09/2012; Min Operating Temperature: 0°C; Manufacturer URL: http://www.st.com/; Pins: 3; Mounting Technology: TH; Output Voltage: 5V; RoHS Compliant: True; Max Ouput Current: 1.5A; Datasheet URL: https://datasheet.ciiva.com/15111/getdatasheetpartid-44136-15111027.pdf; Packaging: Rail/Tube; Max Operating Temperature: 125°C; Case/Package: TO-220; Package Quantity: 50